# EAGLE design sensor_board (EAGLE 9.4.2)
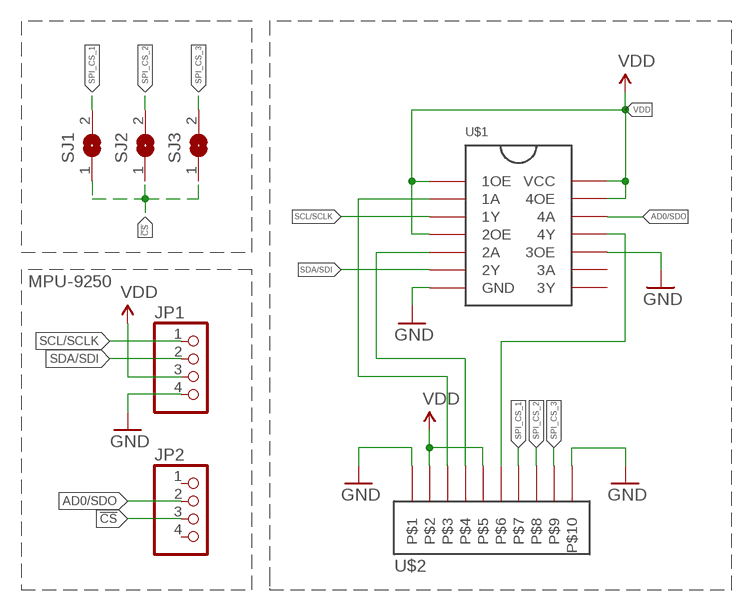
[diagram p0: schematic, sheet 1]

## Parts
JP1  PINHD-1X04_2.54-SMD  [1X04SMD]
JP2  PINHD-1X04_2.54-SMD  [1X04SMD]
SJ1  SJ  [SJ]
SJ2  SJ  [SJ]
SJ3  SJ  [SJ]
U$1  74AHC126D,118  [SOIC127P600X175-14N]
U$2  1-2178711-2  [1-2178712-0]

## Nets
!CS: JP2.3 SJ1.1 SJ2.1 SJ3.1
AD0/SDO: JP2.2 U$1.12(4A)
GND: JP1.4 U$1.7(GND) U$1.10(3OE) U$2.P$1 U$2.P$10
N$1: U$1.2(1A) U$2.P$3
N$2: U$1.11(4Y) U$2.P$6
N$3: U$1.5(2A) U$2.P$4
SCL/SCLK: JP1.1 U$1.3(1Y)
SDA/SDI: JP1.2 U$1.6(2Y)
SPI_CS_1: SJ1.2 U$2.P$7
SPI_CS_2: SJ2.2 U$2.P$8
SPI_CS_3: SJ3.2 U$2.P$9
VDD [VDD]: JP1.3 U$1.1(1OE) U$1.4(2OE) U$1.13(4OE) U$1.14(VCC) U$2.P$2 U$2.P$5
Unconnected: JP2.1 JP2.4 U$1.8(3Y) U$1.9(3A)

## Notes on the sheet
- MPU-9250

## Library data of the parts
JP1 JP2 = pinhead-2:PINHD-1X04: PIN HEADER
SJ1-SJ3 = jumper:SJ: SMD solder JUMPER
U$1 = SamacSys_Parts:74AHC126D,118
U$2 = SamacSys_Parts:1-2178711-2

## Net classes
0 default: width 0.152 mm, drill 0.3 mm, clearance 0.203 mm
1 VDD: width 0.254 mm, drill 0.4 mm, clearance 0.203 mm

## Board
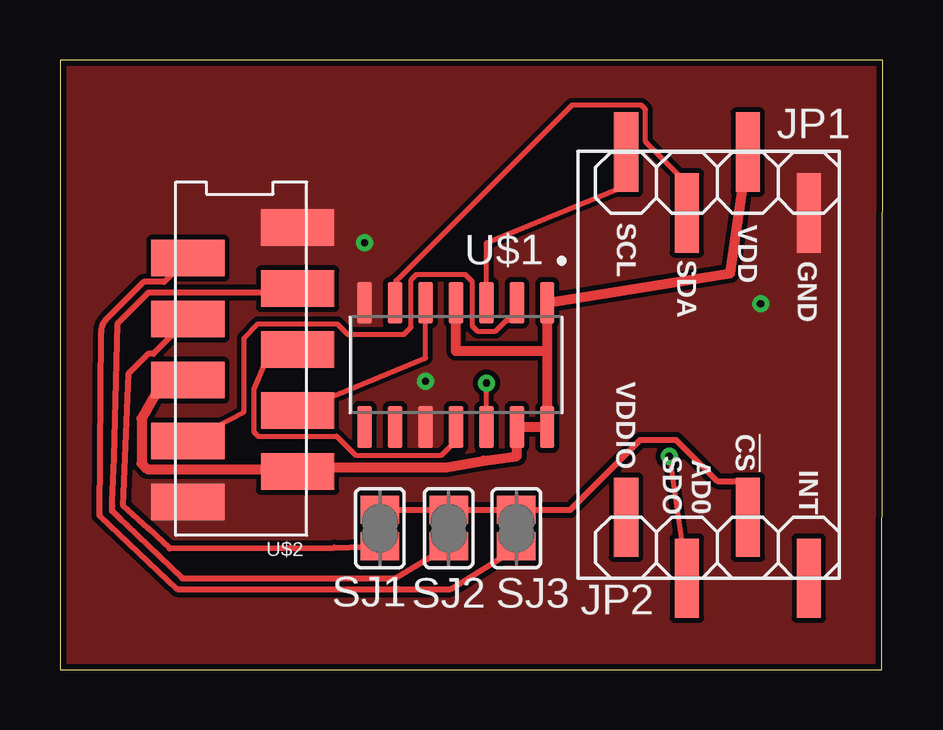
[diagram p1: board, top side]
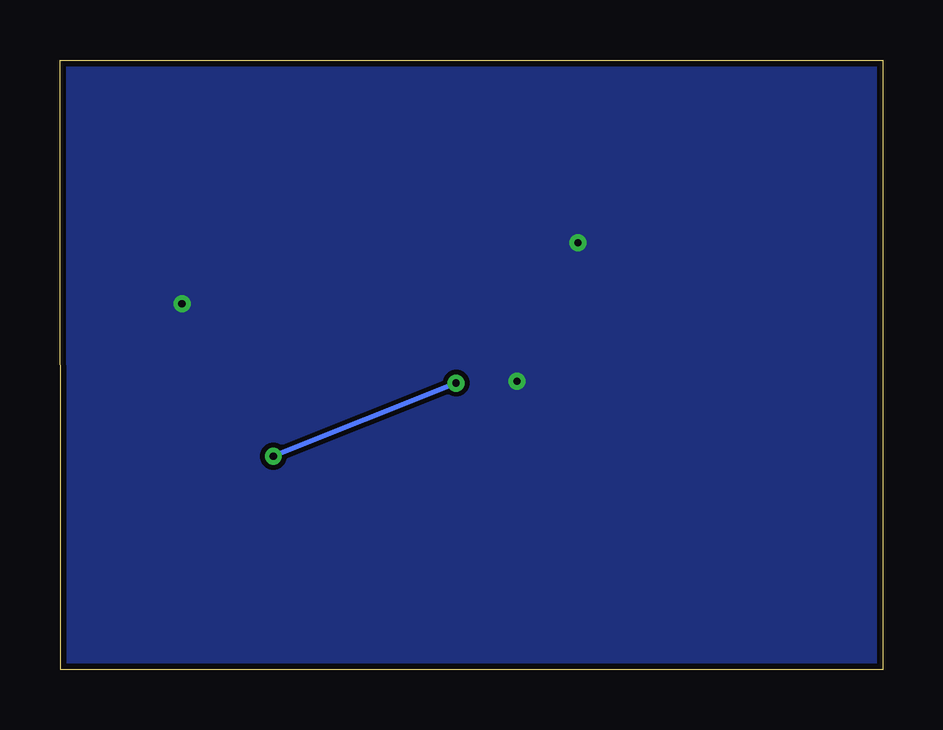
[diagram p2: board, bottom side, seen from below]

Size 34.3 x 25.4 mm. Coordinates in mm from the lower left corner, seen from the top.
Outline: 0,0 34.27,0 34.3,25.4 0,25.4 0,0
Copper layers (1*16): Top 0.035mm / dielectric 1.6mm / Bottom 0.035mm
Design rules "default *": minimum track width 6mil, minimum drill 0.3mm, track to track 6mil, track to pad 6mil, pad to pad 6mil, via to via 6mil, smd to smd 6mil, copper to edge 10mil, drill to drill 6mil, minimum pad ring 10mil, minimum via ring 8mil, stop-mask expansion 4mil, vias tented up to drill 0mil, thermal gap 10mil

### Footprints (pad centres in the part's own frame; a part is rotated, then mirrored left to right if it is on the bottom)
1X04SMD = smd 1.016 x 3.302: 1 -1.27,1.27; 2 1.27,-1.27; 3 3.81,1.27; 4 6.35,-1.27
SJ = smd 1.168 x 1.6: 1 -0.762,0; 2 0.762,0
SOIC127P600X175-14N = smd 1.75 x 0.59: 1 -2.585,3.81; 2 -2.585,2.54; 3 -2.585,1.27; 4 -2.585,0; 5 -2.585,-1.27; 6 -2.585,-2.54; 7 -2.585,-3.81; 8 2.585,-3.81; 9 2.585,-2.54; 10 2.585,-1.27; 11 2.585,0; 12 2.585,1.27; 13 2.585,2.54; 14 2.585,3.81
1-2178712-0 = smd 1.524 x 3.048: P$1 -5.715,2.286; P$2 -4.445,-2.286; P$3 -3.175,2.286; P$4 -1.905,-2.286; P$5 -0.635,2.286; P$6 0.635,-2.286; P$7 1.905,2.286; P$8 3.175,-2.286; P$9 4.445,2.286; P$10 5.715,-2.286

### Placement (x,y rotation side)
JP1  24.87,20.29 0 top
JP2  24.87,5.08 0 top
SJ1  13.34,5.89 270 top
SJ2  16.21,5.89 270 top
SJ3  19.02,5.89 270 top
U$1  16.51,12.7 270 top
U$2  7.62,12.7 90 top

### Tracks (layer width: path | path; a pad name or v marks a point on that pad's centre or on a via)
!CS
  Top 0.254: SJ1.1 SJ2.1 SJ3.1 21.27,6.66 24.19,9.57 25.68,9.57 27.41,7.85 28.45,7.85 JP2.3
AD0/SDO  (via drill 0.3)
  Top 0.203: U$1.12 v17.78,11.94 | v25.4,8.89 JP2.2
  Bottom 0.203: v17.78,11.94 v25.4,8.89
GND  (via drill 0.3)
  other vias: 15.24,12.01 12.7,17.78 29.21,15.24
  pour Top (no thermals): 0,25.4 0,0 34.29,0 34.29,25.4
  pour Bottom (no thermals): 0,25.4 0,0 34.29,0 34.29,25.4
N$1
  Top 0.203: U$2.P$3 7.67,10.73 7.67,13.82 8.26,14.4 11.56,14.4 11.99,13.97 14.34,13.97 14.64,14.27 14.64,16.24 14.86,16.46 16.89,16.46 17.18,16.17 17.18,14.33 17.4,14.11 18.16,14.11 18.61,14.55 18.97,14.55 U$1.2
N$2
  Top 0.203: U$2.P$6 8.74,12.8 8.56,12.8 8.08,11.68 8.08,9.91 8.26,9.73 11.53,9.73 12.32,8.94 15.91,8.94 16.51,9.53 U$1.11
N$3
  Top 0.203: U$2.P$4 15.19,12.97 15.24,12.99 U$1.5
SCL/SCLK
  Top 0.203: U$1.3 17.78,17.78 23.32,20.07 JP1.1
SDA/SDI
  Top 0.203: JP1.2 25.91,20.5 24.41,22 24.41,23.34 24.23,23.52 21.34,23.52 14.03,16.2 13.99,16.2 U$1.6
SPI_CS_1
  Top 0.254: U$2.P$7 3.89,13.16 3.67,13.16 2.87,12.35 2.64,6.82 2.82,6.66 3.67,5.89 4.57,5.05 11.43,5.08 SJ1.2
SPI_CS_2
  Top 0.254: U$2.P$8 9.73,15.7 3.67,15.7 2.41,14.44 2.25,8.84 2.17,6.99 2.18,6.82 2.18,6.6 2.19,6.59 2.52,6.28 2.79,6.03 5.08,3.84 5.08,3.81 13.97,3.81 SJ2.2
SPI_CS_3
  Top 0.254: U$2.P$9 4.34,16.15 3.48,16.15 1.96,14.63 arc45 1.73,14.07 1.65,6.42 4.89,3.35 13.91,3.35 14.04,3.32 14.1,3.35 16.28,3.35 18.54,4.75 SJ3.2
VDD
  Top 0.406: U$1.4 16.51,13.28 20.32,13.28 | 20.32,13.28 U$1.1 27.94,16.51 JP1.3 | 20.32,13.28 U$1.14 U$1.13 19.05,8.89 17.67,8.71 16.12,8.43 10.08,8.43 U$2.P$2 9.8,8.36 3.64,8.36 3.4,8.6 3.4,10.46 4.07,11.63 4.39,11.63 U$2.P$5

### Text on the board
tPlace: SCL | VDD | SDA | GND | VDDIO | !CS | AD0 / SDO | INT
bDocu: Praca Magisterska / AGH, Elektronika i Telekomunikacja, / Systemy Wbudowane / Autor: Damian Świerk / 2019